# EAGLE design Amazing-All-Band-Receiver-alt (EAGLE 7.2.0)
The Amazing All-Band Receiver http://www.techlib.com/electronics/allband.htm http://theradioboard.com/rb/viewtopic.php?t=4625 http://www.transkommunikation.ch/dateien/schaltungen/diverse_schaltungen/radio_circuits/Amazing%20All-Band%20Receiver.pdf
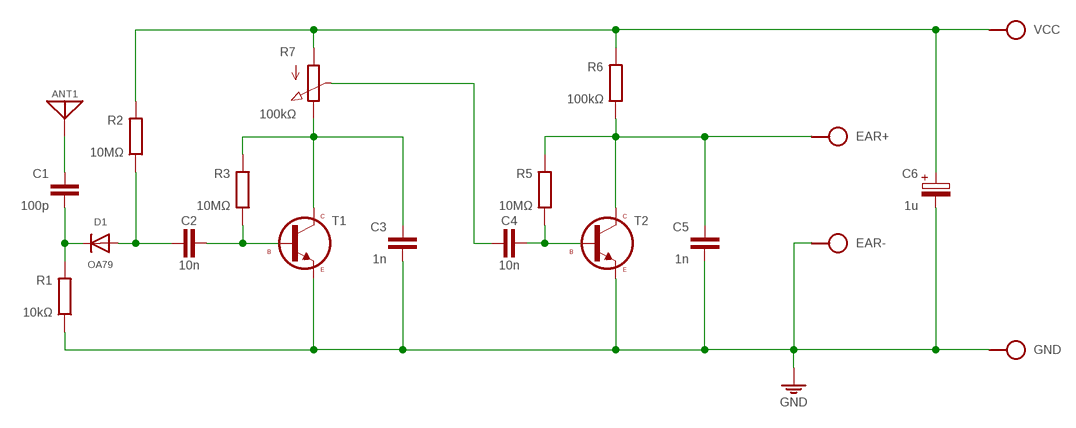
[diagram p0: schematic, sheet 1]

## Parts
ANT1  ANT  [SPAD]
C1  100p  C050-020X036/V  [C050-020X036/V]
C2  10n  C050-020X036  [C050-020X036]
C3  1n  C050-020X036  [C050-020X036]
C4  10n  C050-020X036  [C050-020X036]
C5  1n  C050-020X036  [C050-020X036]
C6  1u  CPOLE2,5-3  [E2,5-3]
D1  OA79  1N414834-7V  [DO34-7V]
EAR+  SPAD  [SPAD]
EAR-  SPAD  [SPAD]
GND  SPAD  [SPAD]
R1  10kΩ  R0202/7-V  [0202/7-V]
R2  10MΩ  R0202/7  [0202/7]
R3  10MΩ  R0202/7-V  [0202/7-V]
R5  10MΩ  R0202/7-V  [0202/7-V]
R6  100kΩ  R0202/7-V  [0202/7-V]
R7  100kΩ  POT  [POT]
T1  BC547-TO92-CBE  [TO92-CBE]
T2  BC547  [TO92]
VCC  SPAD  [SPAD]

## Nets
AC: C1.2 D1.C R1.2
ANT: ANT1.1 C1.1
DC: C2.2 D1.A R2.1
GND: C3.2 C5.2 C6.- EAR-.1 GND.1 R1.1 T1.3(E) T2.3(E)
I1: C2.1 R3.1 T1.2(B)
I2: C4.1 R5.1 T2.2(B)
O1: C3.1 R3.2 R7.3(E) T1.1(C)
O2: C5.1 EAR+.1 R5.2 R6.1 T2.1(C)
VCC: C6.+ R2.2 R6.2 R7.1(A) VCC.1
VO1: C4.2 R7.2(S)

## Library data of the parts
ANT1 = pad:ANT
C1-C5 = c:C: CAPACITOR, European symbol
C6 = c:CPOL: POLARIZED CAPACITOR, European symbol
D1 = d:1N4148
EAR+ EAR- GND VCC = pad:SPAD
R1-R3 R5 R6 = r:R: RESISTOR, European symbol
R7 = r:POT
T1 T2 = t:BC547

## Net classes
0 default: width 0.61 mm

## Board
The Amazing All-Band Receiver http://www.techlib.com/electronics/allband.htm http://theradioboard.com/rb/viewtopic.php?t=4625 http://www.transkommunikation.ch/dateien/schaltungen/diverse_schaltungen/radio_circuits/Amazing%20All-Band%20Receiver.pdf
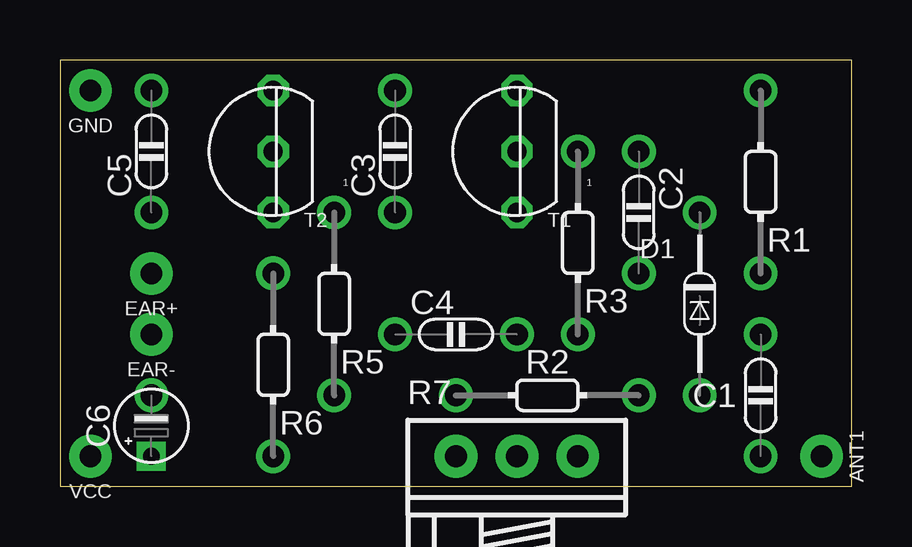
[diagram p1: board, top side]
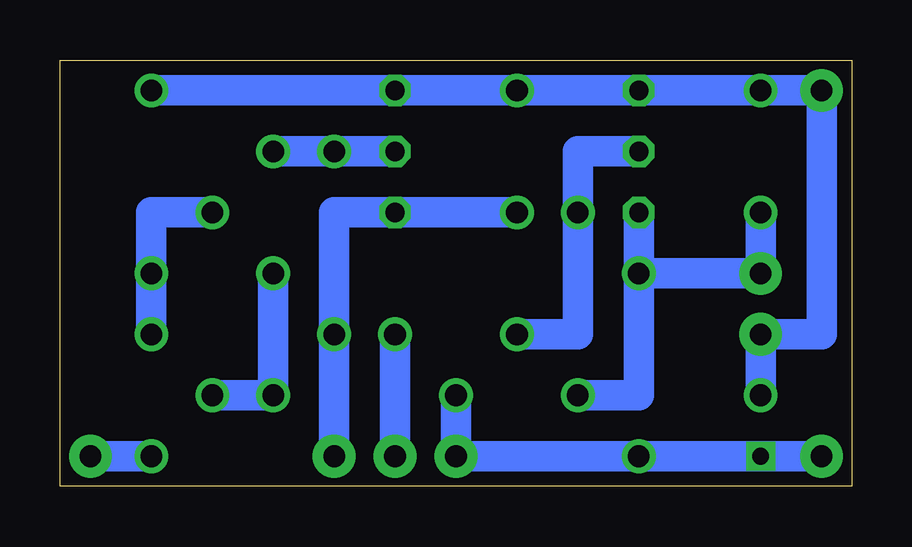
[diagram p2: board, bottom side, seen from below]

Size 33.02 x 17.77 mm. Coordinates in mm from the lower left corner, seen from the top.
Outline: 33.02,17.77 0,17.77 0,0 33.02,0 33.02,17.77
Copper layers (1*16): Top 0.035mm / dielectric 1.5mm / Bottom 0.035mm
Design rules "default": minimum track width 10mil, minimum drill 24mil, track to track 8mil, track to pad 8mil, pad to pad 8mil, via to via 8mil, smd to smd 8mil, copper to edge 40mil, drill to drill 8mil, minimum pad ring 10mil, minimum via ring 8mil, stop-mask expansion 4mil, vias tented up to drill 0mil, thermal gap 10mil

### Footprints (pad centres in the part's own frame; a part is rotated, then mirrored left to right if it is on the bottom)
SPAD = drill 0.9 pad 1.778: 1 0,0
C050-020X036/V = drill 0.9: 1 0,-2.54; 2 0,2.54
C050-020X036 = drill 0.9: 1 -2.54,0; 2 2.54,0
E2,5-3 = drill 0.7 square: + 0,1.27 | drill 0.9: - 0,-1.27
DO34-7V = drill 0.9: A 0,-3.81; C 0,3.81
0202/7-V = drill 0.9: 1 0,-3.81; 2 0,3.81
0202/7 = drill 0.9: 1 0,3.81; 2 0,-3.81
POT = drill 0.9 pad 1.778: 1 -2.54,0; 2 0,0; 3 2.54,0
TO92 = drill 0.8 octagon: 1 0,2.54; 2 0,0; 3 0,-2.54

### Placement (x,y rotation side)
ANT1  31.75,1.26 180 top
C1  29.21,3.8 0 top
C2  24.13,11.42 270 top
C3  13.97,13.96 90 top
C4  16.51,6.34 0 top
C5  3.81,13.96 90 top
C6  3.81,2.53 180 top
D1  26.67,7.61 0 top
EAR+  3.81,8.88 90 top
EAR-  3.81,6.34 90 top
GND  1.27,16.5 90 top
R1  29.21,12.69 180 top
R2  20.32,3.8 270 top
R3  21.59,10.15 180 top
R5  11.43,7.61 180 top
R6  8.89,5.07 180 top
R7  19.05,1.26 0 top
T1  2N2907  [TO92]  19.05,13.96 180 top
T2  2N2907  [TO92]  8.89,13.96 180 top
VCC  1.27,1.26 90 top

### Tracks (layer width: path | path; a pad name or v marks a point on that pad's centre or on a via)
AC
  Bottom 1.27: D1.C 29.21,11.42 R1.2 C1.2
ANT
  Bottom 1.27: ANT1.1 C1.1
DC
  Bottom 1.27: D1.A R2.1 C2.2
GND  (via drill 0.6)
  Bottom 1.27: C5.2 GND.1 | C6.- EAR-.1 1.27,6.34 GND.1 | R1.1 T1.3 C3.2 T2.3 GND.1
  other vias: 1.27,16.5
I1
  Bottom 1.27: C2.1 R3.1 T1.2
I2
  Bottom 1.27: C4.1 11.43,6.34 R5.1 11.43,13.96 T2.2
O1
  Bottom 1.27: R7.3 R3.2 21.59,11.42 T1.1 C3.1
O2
  Bottom 1.27: R5.2 8.89,3.8 R6.1 | C5.1 EAR+.1 R6.1 | R6.1 T2.1
VCC
  Bottom 1.27: R2.2 R7.1 R6.2 C6.+ VCC.1
VO1
  Bottom 1.27: R7.2 C4.2